# Altium schematic sheet Copy of uARM.SchDoc
size A
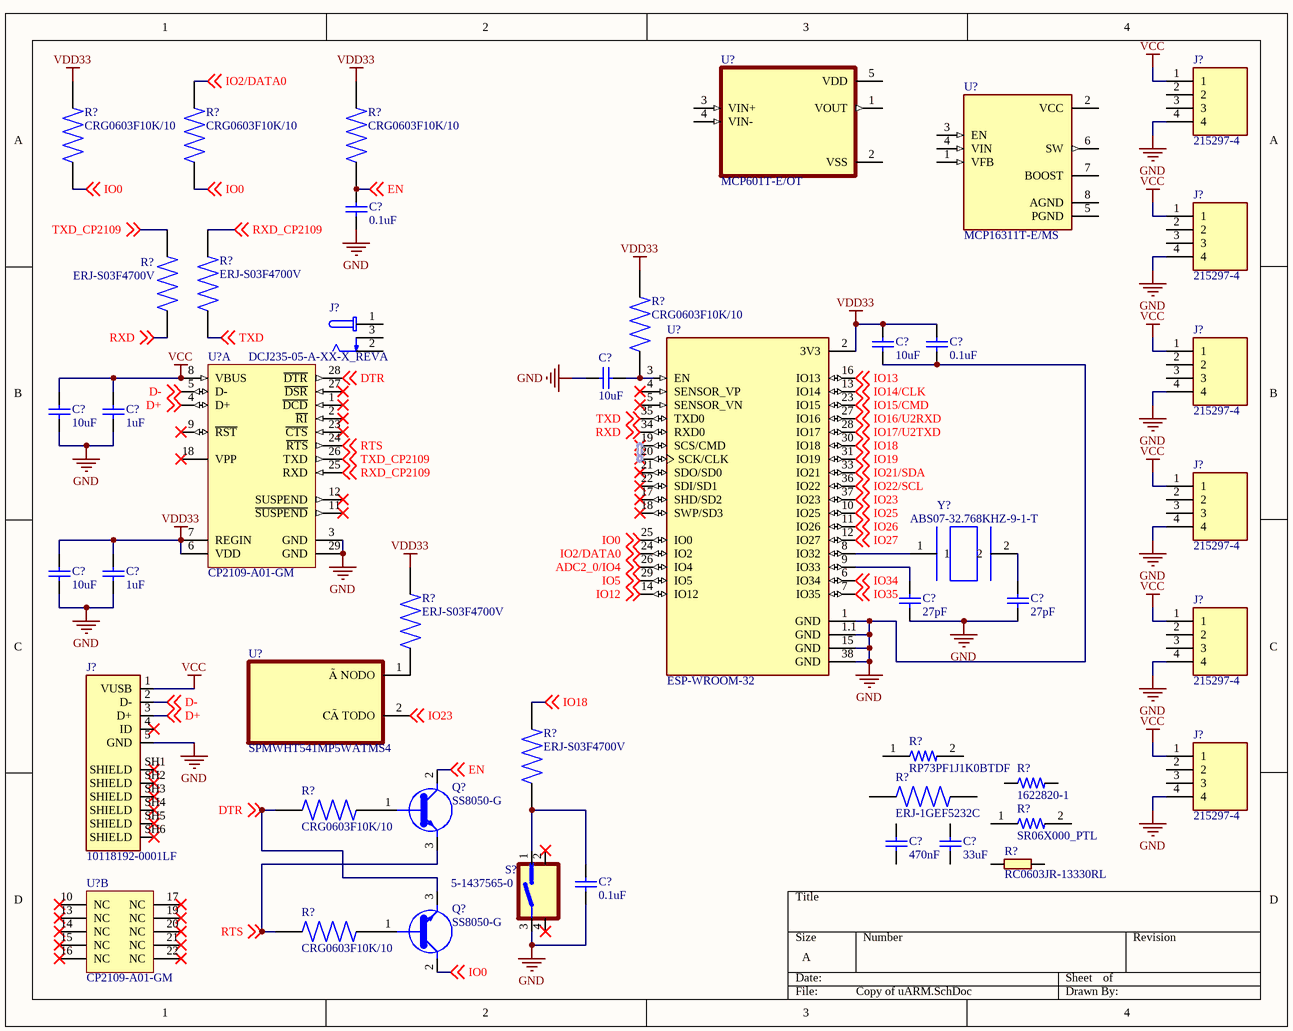
[diagram p0: Copy of uARM.SchDoc]

## Parts
(Parts that share a designator on the sheet are numbered #1, #2 ... from top to bottom, then left to right.)
C?#1  value 0.1uF  [C_3216[1206]_N]  (hidden comment: C1206C106K3RACTU)
C?#2  value 10uF  [C_3216[1206]_N]  (hidden comment: C1206C106K3RACTU)
C?#3  value 0.1uF  [C_3216[1206]_N]  (hidden comment: C1206C106K3RACTU)
C?#4  value 10uF  [C_3216[1206]_N]  (hidden comment: C1206C106K3RACTU)
C?#5  value 10uF  [C_3216[1206]_N]  (hidden comment: C1206C106K3RACTU)
C?#6  value 1uF  [C_3216[1206]_N]  (hidden comment: C1206C106K3RACTU)
C?#7  value 10uF  [C_3216[1206]_N]  (hidden comment: C1206C106K3RACTU)
C?#8  value 1uF  [C_3216[1206]_N]  (hidden comment: C1206C106K3RACTU)
C?#9  value 27pF  [C_3216[1206]_N]  (hidden comment: C1206C106K3RACTU)
C?#10  value 27pF  [C_3216[1206]_N]  (hidden comment: C1206C106K3RACTU)
C?#11  value 470nF  [C_3216[1206]_N]  (hidden comment: C1206C106K3RACTU)
C?#12  value 33uF  [C_3216[1206]_N]  (hidden comment: C1206C106K3RACTU)
C?#13  value 0.1uF  [C_3216[1206]_N]  (hidden comment: C1206C106K3RACTU)
J?#1  215297-4  [TE_215297-4]
J?#2  215297-4  [TE_215297-4]
J?#3  DCJ235-05-A-XX-X_REVA  [GCT_DCJ235-05-A-XX-X_REVA]
J?#4  215297-4  [TE_215297-4]
J?#5  215297-4  [TE_215297-4]
J?#6  215297-4  [TE_215297-4]
J?#7  10118192-0001LF  [AMPHENOL_10118192-0001LF]
J?#8  215297-4  [TE_215297-4]
Q?#1  SS8050-G  [MBTB-T-SOT23]
Q?#2  SS8050-G  [MBTB-T-SOT23]
R?#1  CRG0603F10K/10  [RESC1608X55N]
R?#2  CRG0603F10K/10  [RESC1608X55N]
R?#3  CRG0603F10K/10  [RESC1608X55N]
R?#4  ERJ-S03F4700V  [RESC1608X55N]
R?#5  ERJ-S03F4700V  [RESC1608X55N]
R?#6  CRG0603F10K/10  [RESC1608X55N]
R?#7  ERJ-S03F4700V  [RESC1608X55N]
R?#8  ERJ-S03F4700V  [RESC1608X55N]
R?#9  RP73PF1J1K0BTDF  [RESC1608X50N]
R?#10  1622820-1  [RESC6331X70N]
R?#11  ERJ-1GEF5232C  [RESC0603X26N]
R?#12  CRG0603F10K/10  [RESC1608X55N]
R?#13  SR06X000_PTL  [RESC1608X55]
R?#14  RC0603JR-13330RL  [0603]
R?#15  CRG0603F10K/10  [RESC1608X55N]
S?  5-1437565-0  [SW_5-1437565-0]
U?#1  MCP601T-E/OT  [SOT95P270X145-5N]
U?#2  MCP16311T-E/MS  [SOP65P490X110-8N]
U?#3  CP2109-A01-GM  [SLAB-QFN-28-3125x3125TP_L]  (part A of 2)
U?#4  ESP-WROOM-32  [MODULE_ESP-WROOM-32]
U?#5  SPMWHT541MP5WATMS4  [LED_SPMWHT541MP5WAPKS4]
U?#6  CP2109-A01-GM  [SLAB-QFN-28-3125x3125TP_L]  (part B of 2)
Y?  ABS07-32.768KHZ-9-1-T  [XTAL320X150X90]

## Nets
GND: C?#1.1 C?#2.1 C?#3.1 C?#4.2 C?#5.1 C?#6.1 C?#7.1 C?#8.1 C?#9.1 C?#10.1 C?#13.1 J?#1.4 J?#2.4 J?#4.4 J?#5.4 J?#6.4 J?#7.5(GND) J?#8.4 S?.3 U?#3.3(GND) U?#3.29(GND) U?#4.1(GND) U?#4.1.1(GND) U?#4.15(GND) U?#4.38(GND)
VCC: C?#5.2 C?#6.2 J?#1.1 J?#2.1 J?#4.1 J?#5.1 J?#6.1 J?#7.1(VUSB) J?#8.1 U?#3.8(VBUS)
VDD33: C?#2.2 C?#3.2 C?#7.2 C?#8.2 R?#1.1 R?#3.1 R?#6.2 R?#7.2 U?#3.6(VDD) U?#3.7(REGIN) U?#4.2(3V3)
ADC2_0/IO4: U?#4.26(IO4) ; off-sheet ADC2_0/IO4
D+: J?#7.3(D+) U?#3.4(D+) ; off-sheet D+
D-: J?#7.2(D-) U?#3.5(D-) ; off-sheet D-
DTR: Q?#2.3(C) R?#12.2 U?#3.28(~{DTR}) ; off-sheet DTR
EN: C?#1.2 Q?#1.2(E) R?#3.2 ; off-sheet EN
IO0: Q?#2.2(E) R?#1.2 R?#2.2 U?#4.25(IO0) ; off-sheet IO0
IO2/DATA0: R?#2.1 U?#4.24(IO2) ; off-sheet IO2/DATA0
IO5: U?#4.29(IO5) ; off-sheet IO5
IO12: U?#4.14(IO12) ; off-sheet IO12
IO13: U?#4.16(IO13) ; off-sheet IO13
IO14/CLK: U?#4.13(IO14) ; off-sheet IO14/CLK
IO15/CMD: U?#4.23(IO15) ; off-sheet IO15/CMD
IO16/U2RXD: U?#4.27(IO16) ; off-sheet IO16/U2RXD
IO17/U2TXD: U?#4.28(IO17) ; off-sheet IO17/U2TXD
IO18: R?#8.2 U?#4.30(IO18) ; off-sheet IO18
IO19: U?#4.31(IO19) ; off-sheet IO19
IO21/SDA: U?#4.33(IO21) ; off-sheet IO21/SDA
IO22/SCL: U?#4.36(IO22) ; off-sheet IO22/SCL
IO23: U?#4.37(IO23) U?#5.2(CÃTODO) ; off-sheet IO23
IO25: U?#4.10(IO25) ; off-sheet IO25
IO26: U?#4.11(IO26) ; off-sheet IO26
IO27: U?#4.12(IO27) ; off-sheet IO27
IO34: U?#4.6(IO34) ; off-sheet IO34
IO35: U?#4.7(IO35) ; off-sheet IO35
RTS: Q?#1.3(C) R?#15.2 U?#3.24(~{RTS}) ; off-sheet RTS
RXD: R?#4.1 U?#4.34(RXD0) ; off-sheet RXD
RXD_CP2109: R?#5.2 U?#3.25(RXD) ; off-sheet RXD_CP2109
TXD: R?#5.1 U?#4.35(TXD0) ; off-sheet TXD
TXD_CP2109: R?#4.2 U?#3.26(TXD) ; off-sheet TXD_CP2109
NetC?#4_1: C?#4.1 R?#6.1 U?#4.3(EN)
NetC?#9_2: C?#9.2 U?#4.9(IO33)
NetC?#10_2: C?#10.2 Y?.2
NetC?#13_2: C?#13.2 R?#8.1 S?.1
NetQ?#1_1: Q?#1.1(B) R?#12.1
NetQ?#2_1: Q?#2.1(B) R?#15.1
NetR?#7_1: R?#7.1 U?#5.1(ÃNODO)
NetU?#4_8: U?#4.8(IO32) Y?.1

Not connected (* = marked no-connect by the designer): C?#11 1 2; C?#12 1 2; J?#1 2 3; J?#2 2 3; J?#3 1 2 3; J?#4 2 3; J?#5 2 3; J?#6 2 3; J?#7 4(ID)* SH1(SHIELD)* SH2(SHIELD)* SH3(SHIELD)* SH4(SHIELD)* SH5(SHIELD)* SH6(SHIELD)*; J?#8 2 3; R?#9 1 2; R?#10 1 2; R?#11 1 2; R?#13 1 2; R?#14 1 2; S? 2* 4(1)*; U?#1 1(VOUT) 2(VSS) 3(VIN+) 4(VIN-) 5(VDD); U?#2 1(VFB) 2(VCC) 3(EN) 4(VIN) 5(PGND) 6(SW) 7(BOOST) 8(AGND); U?#3 1(~{DCD})* 2(~{RI})* 9(~{RST})* 11(~{SUSPEND})* 12(SUSPEND)* 18(VPP)* 23(~{CTS})* 27(~{DSR})*; U?#4 4(SENSOR_VP)* 5(SENSOR_VN)* 17(SHD/SD2)* 18(SWP/SD3)* 19(SCS/CMD)* 20(SCK/CLK)* 21(SDO/SD0)* 22(SDI/SD1)*; U?#6 10(NC)* 13(NC)* 14(NC)* 15(NC)* 16(NC)* 17(NC)* 19(NC)* 20(NC)* 21(NC)* 22(NC)*

## Library data of the parts
C?#1-C?#13 = C_10uf_3216[1206]: Capacitor Céramique 10uf XR7 25V 10%; Manufacturer: KEMET; ManufacturerPartNumber: C1206C106K3RACTU; Supplier 1: Digi-Key; Supplier Part Number 1: 399-7442-1-ND; MountingType: SMT
J?#1 J?#2 J?#4-J?#6 J?#8 = 215297-4: MF: {'manufacturer': u'TE Connectivity'}; Package: None; Price: None; Availability: Unavailable; MP: 215297-4; Value: *
J?#3 = DCJ235-05-A-XX-X_REVA: DC Power Jack, Thru-Hole, Horizontal, with Locating Pegs, D2.35mm; MF: {'manufacturer': u'Global Connector Technology'}; Availability: Unavailable; Package: None; Price: None; MP: DCJ235-05-A-XX-X_REVA; Value: *
J?#7 = 10118192-0001LF: Single Port 5 Contact Horizontal Right Angle Shielded Micro B USB 2.0 Connector; MF: {'manufacturer': u'FCI'}; Package: None; MP: 10118192-0001LF; Price: None; Value: *; Availability: Unavailable
Q?#1 Q?#2 = SS8050-G: <b>Bipolar Transistors - BJT NPN TRANSISTOR 1.5A 40V</b><p> Source: <a href="https://componentsearchengine.com/Datasheets/1/SS8050-G.pdf"> Datasheet </a>; MF: {'manufacturer': u'Comchip Technology'}; Package: None; Value: *; MP: SS8050-G; Availability: Unavailable; Price: None
R?#1-R?#3 R?#6 R?#12 R?#15 = CRG0603F10K/10: Thick Film Resistors - SMD CRG0603 1% 10K 10K RL; MF: {'manufacturer': u'TE Connectivity'}; Value: *; Price: None; MP: CRG0603F10K/10; Package: None; Availability: Unavailable
R?#4 R?#5 R?#7 R?#8 = ERJ-S03F4700V: MF: {'manufacturer': u'Panasonic'}; Package: None; Value: *; Price: None; MP: ERJ-S03F4700V; Availability: Unavailable
R?#9 = RP73PF1J1K0BTDF: Thin Film Fixed Resistor 0603 Case 1kOhm +/-0.1% 0.166W +/-25ppm/degC; MF: {'manufacturer': u'TE Connectivity'}; Price: None; Availability: Unavailable; Package: None; Value: *; MP: RP73PF1J1K0BTDF
R?#10 = 1622820-1: 3520 100K 5%; MF: {'manufacturer': u'TE Connectivity'}; Package: None; MP: 1622820-1; Value: *; Availability: Unavailable; Price: None
R?#11 = ERJ-1GEF5232C: Res Thick Film 0201 52.3K Ohm 1% 0.05W(1/20W) Â±200ppm/C SMD T/R; MF: {'manufacturer': u'Panasonic'}; Package: None; MP: ERJ-1GEF5232C; Value: *; Availability: Unavailable; Price: None
R?#13 = SR06X000_PTL: MP: SR06X000 PTL; MF: {'manufacturer': u'Walsin Technologies'}; Price: None; Package: None; Value: *; Availability: Unavailable
R?#14 = RC0603JR-13330RL: https://octopart.com/rc0603fr-13100kl-yageo-12819546; MF: {'manufacturer': u'Yageo'}; MP: RC0603JR-13330RL; Price: None; Package: None; Value: *; Availability: Unavailable
S? = 5-1437565-0: Switch Tactile OFF (ON) Round Button Gull Wing 0.05A 12VDC 1.57N SMD T/R; MF: {'manufacturer': u'TE Connectivity'}; MP: 5-1437565-0; Package: None; Price: None; Value: *; Availability: Unavailable
U?#1 = MCP601T-E/OT: MF: {'manufacturer': u'Microchip'}; Package: None; MP: MCP601T-E/OT; Price: None; Value: *; Availability: Unavailable
U?#2 = MCP16311T-E/MS: The MCP16311/2 is a compact, high-efficiency, fixed frequency, synchronous step-down DC-DC converter in an 8-pin MSOP, or 2 x 3 TDFN package that operates from input voltage sources up to 30V. Integrated features include a high-side and a low-side switch, fixed frequency peak current mode control, internal compensation, peak current limit and overtemperature protection. The MCP16311/2 provides all the active functions for local DC-DC conversion, with fast transient response and accurate regulation.; MF: {'manufacturer': u'Microchip Technology'}; MP: MCP16311T-E/MS; Value: *; Package: None; Price: None; Availability: Unavailable
U?#3 U?#6 = CP2109-A01-GM: Single-Chip USB to UART Bridge, 1024 Bytes EEPROM, -40 to 85 degC, 28-pin QFN, Tube; Manufacturer: Silicon Labs; Sub-Family: USB Bridges; Internal Oscillator: TRUE; ComponentLink1Description: Manufacturer URL; ComponentLink2Description: Datasheet; PartNumber: CP2109-A01-GM; ComponentLink3Description: Package Specification; ComponentLink3URL: http://www.silabs.com/Support%20Documents/TechnicalDocs/C8051T61x.pdf; DatasheetVersion: Rev. 1.5; ComponentLink1URL: http://www.silabs.com/; ComponentLink2URL: http://www.silabs.com/Support%20Documents/TechnicalDocs/CP2102-9.pdf; Code_IPC: J-STD-020C; Mounting Technology: Surface Mount; PackageDescription: 28-Pin Quad-Flat No-Leads Package, Body 5 x 5 mm, Pitch 0.5 mm; Code_JEDEC: MO-220; EEPROM: 1024 Bytes; PackageReference: QFN-28
U?#4 = ESP-WROOM-32: Module: combo; GPIO, I2C x2, I2S x2, SDIO, SPI x3, UART x3; 19.5dBm; MF: {'manufacturer': u'Espressif Systems'}; Availability: Unavailable; MP: ESP-WROOM-32; Value: *; Price: None; Package: None
U?#5 = SPMWHT541MP5WATMS4: MF: {'manufacturer': u'Samsung Semiconductor,'}; Package: None; Value: *; MP: SPMWHT541MP5WATMS4; Availability: Unavailable; Price: None
Y? = ABS07-32.768KHZ-9-1-T: ABS07 Series 32.768 kHz Â±20 ppm 12.5 pF -40 to +85 C SMT Low Profile Crystal; MF: {'manufacturer': u'Abracon'}; Package: None; MP: ABS07-32.768KHZ-9-1-T; Price: None; Value: *; Availability: Unavailable